# Altium schematic sheet STM32&Power.SchDoc
size A2
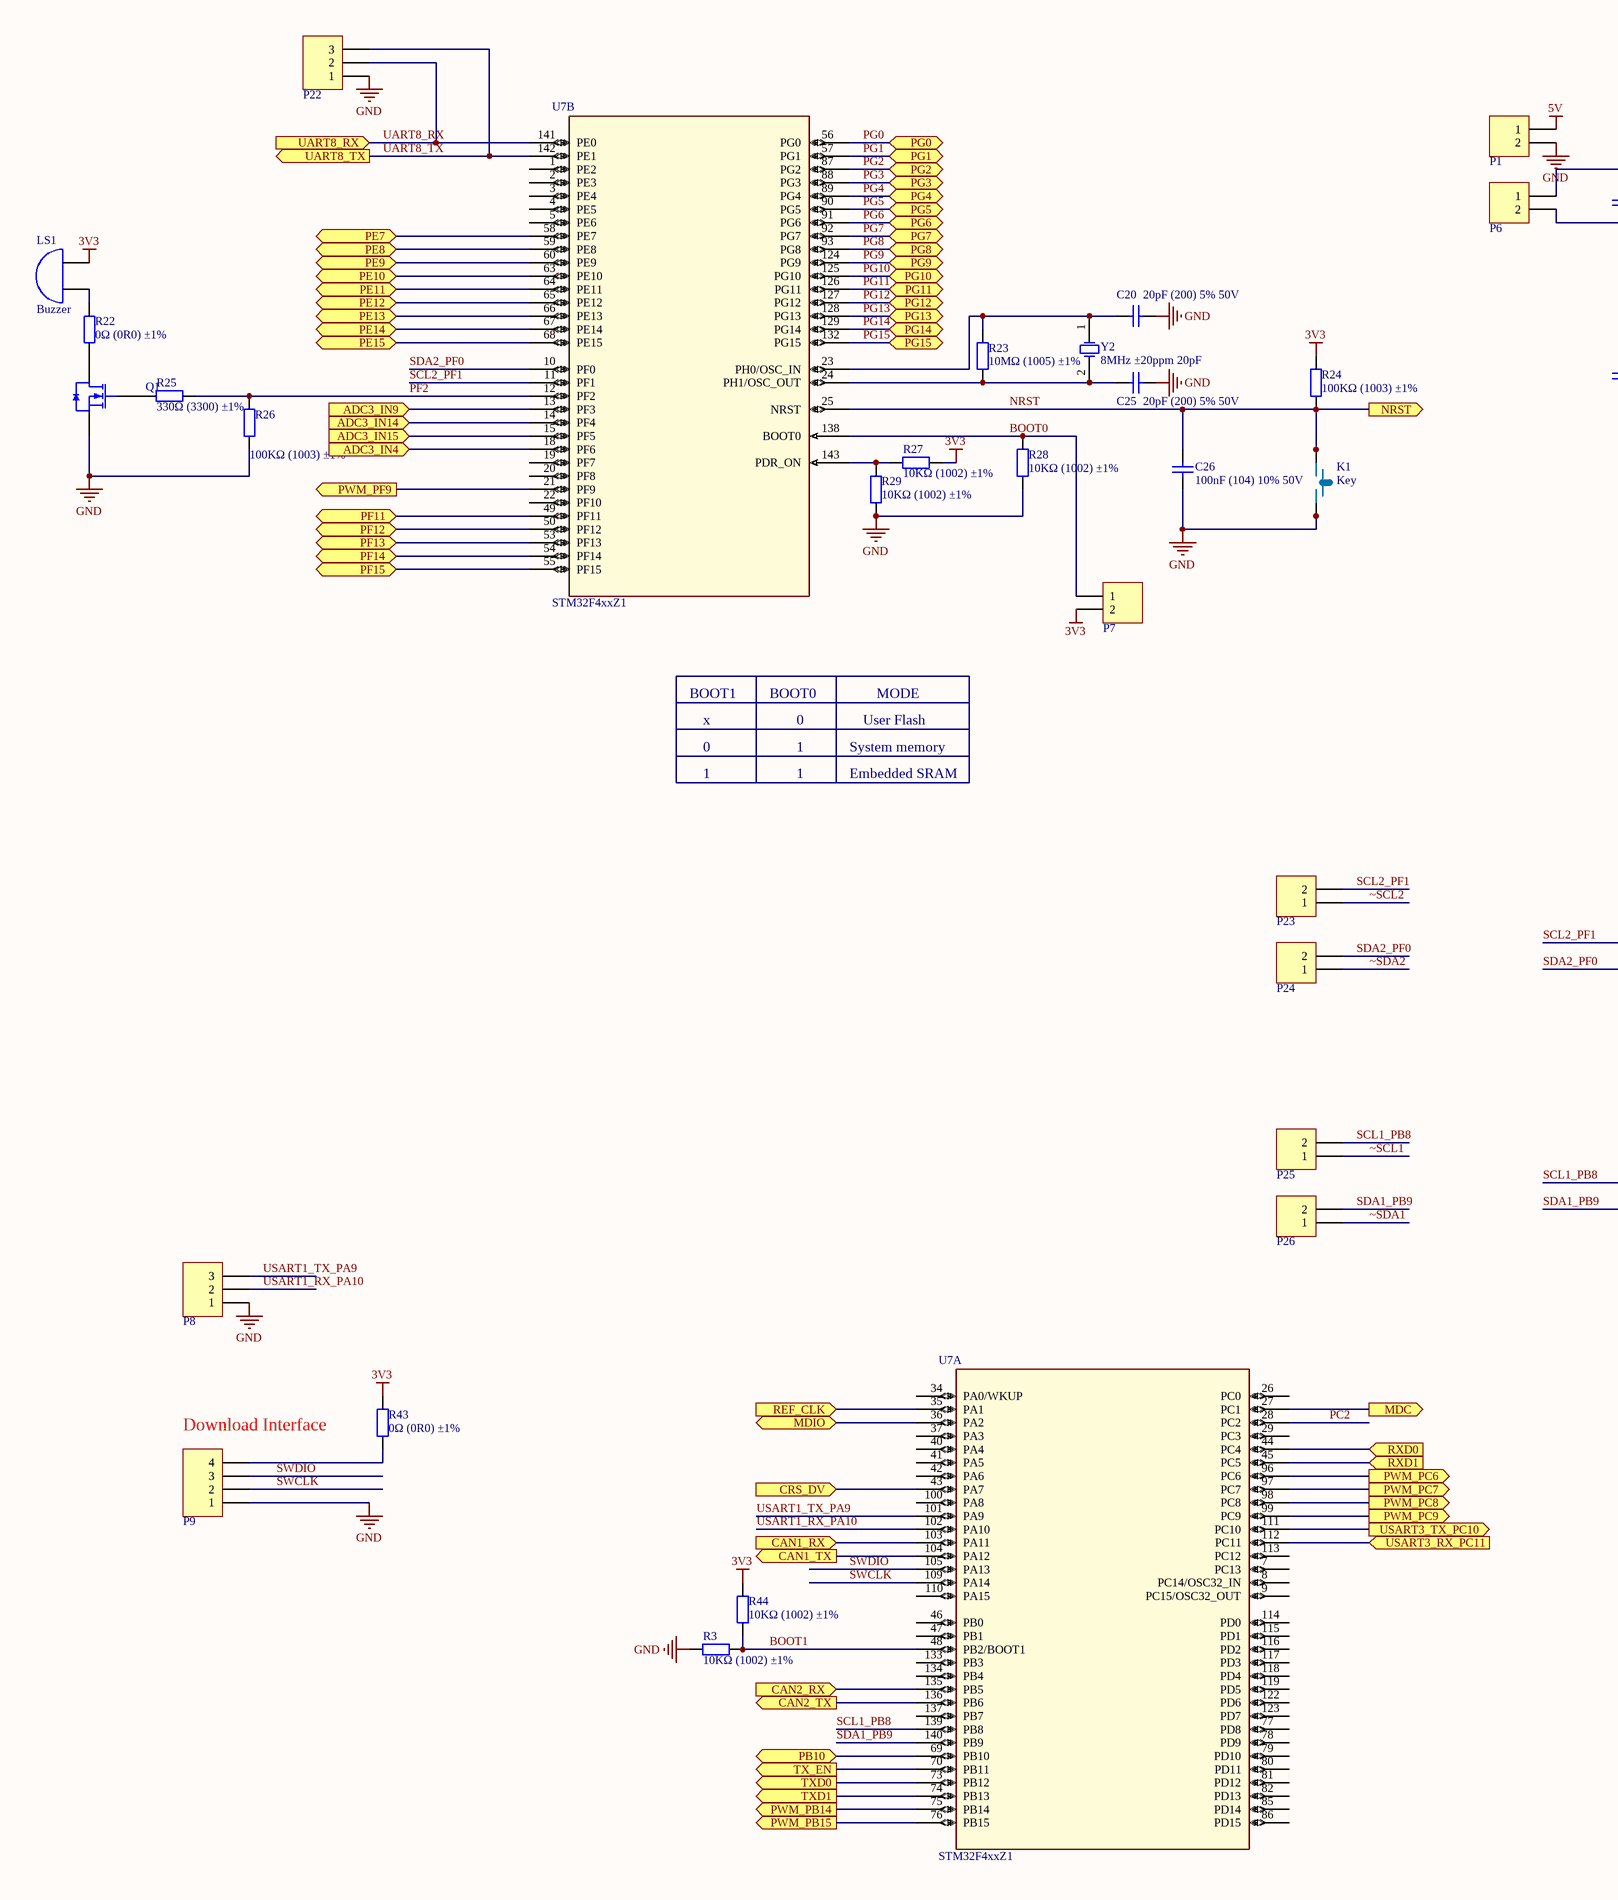
[diagram p0: STM32&Power.SchDoc, left]
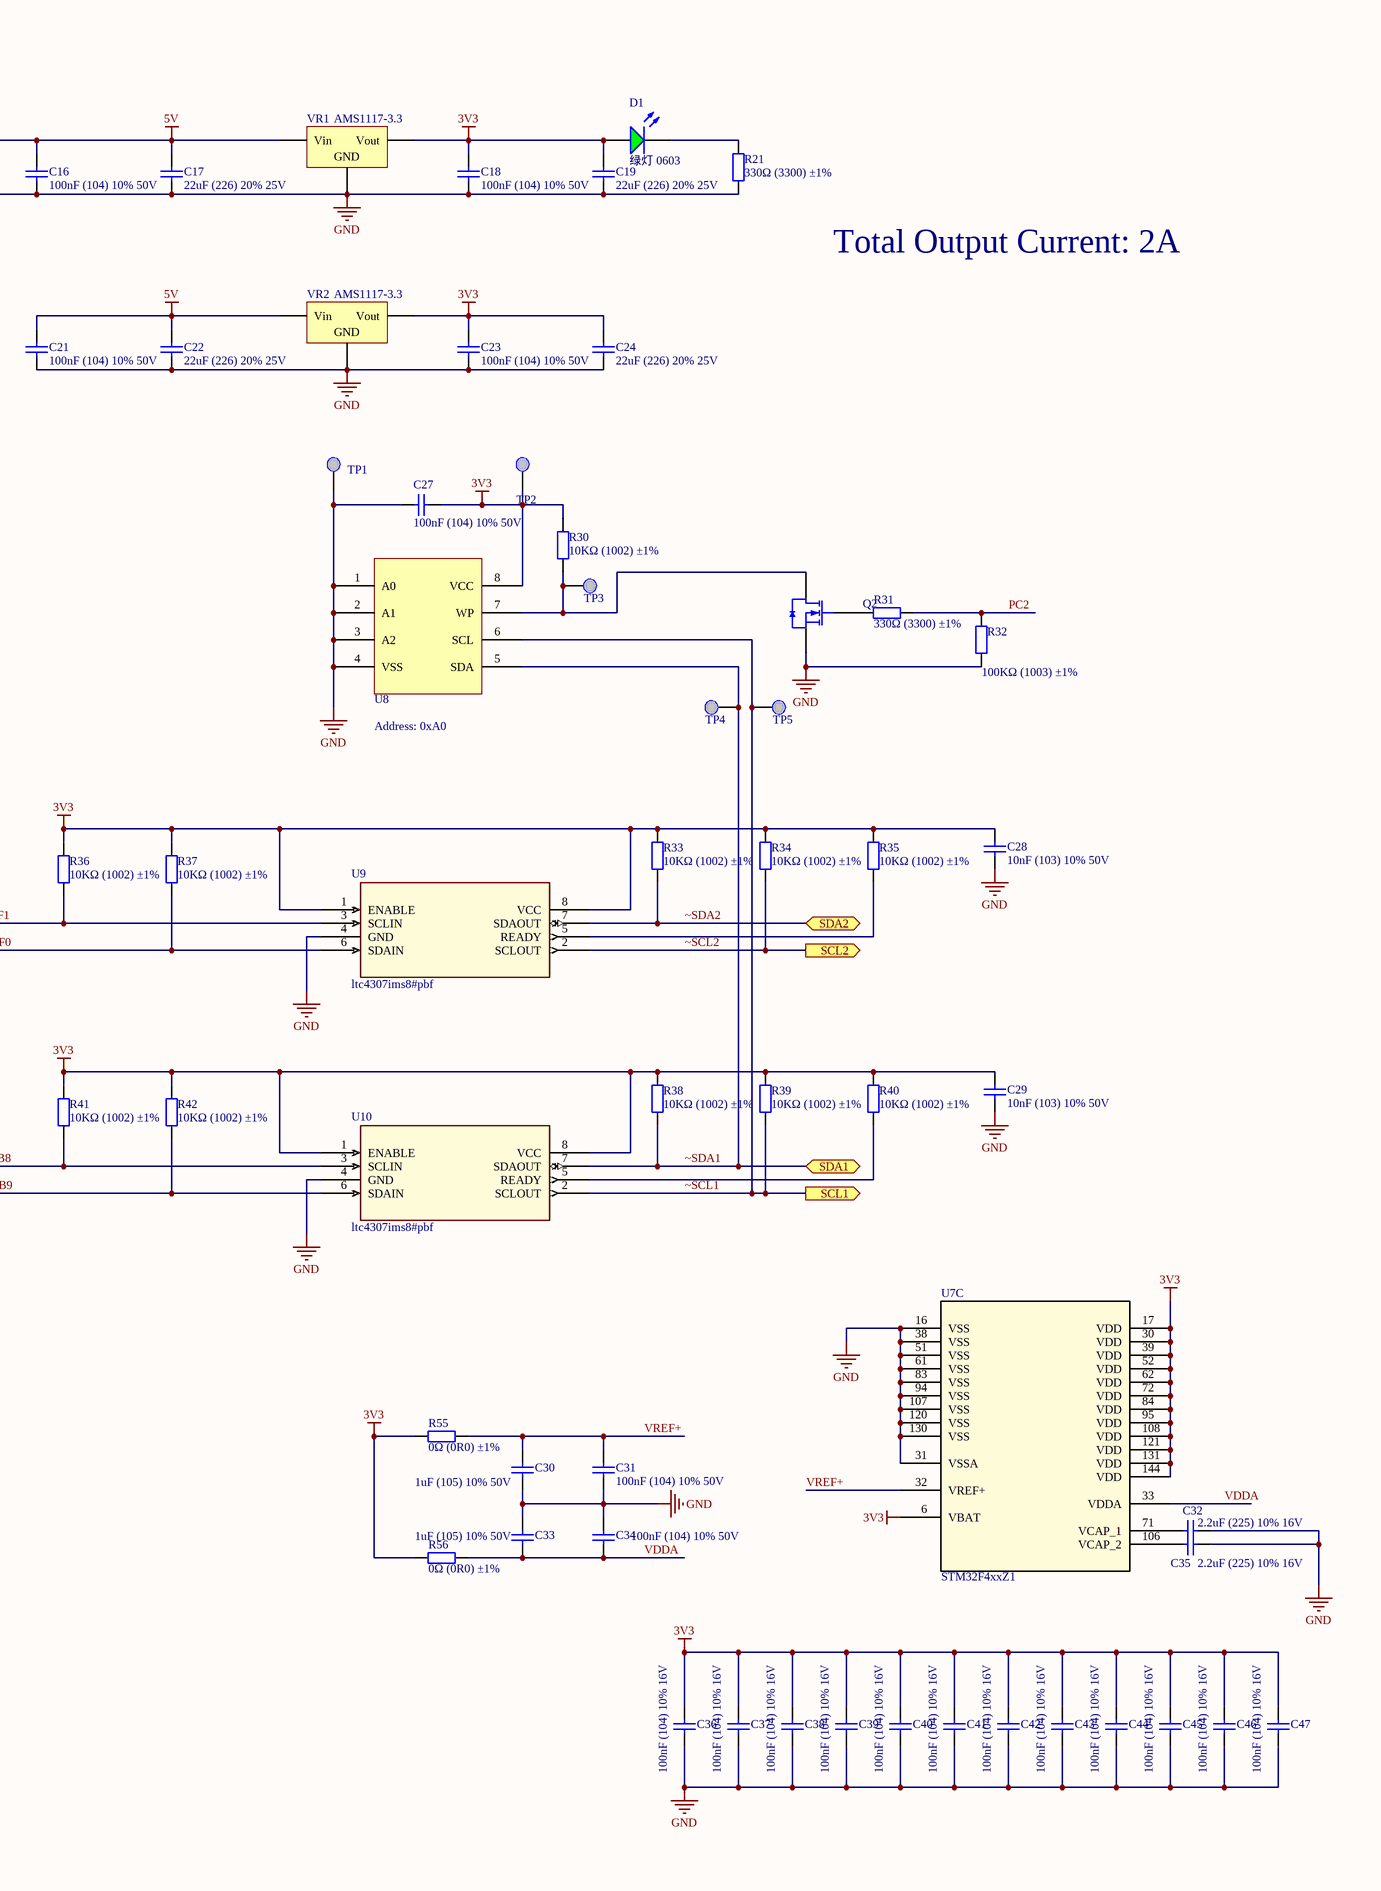
[diagram p1: STM32&Power.SchDoc, right]

## Parts
C16  100nF (104) 10% 50V  [0603_C]
C17  22uF (226) 20% 25V  [0805_C]
C18  100nF (104) 10% 50V  [0603_C]
C19  22uF (226) 20% 25V  [0805_C]
C20  20pF (200) 5% 50V  [0603_C]
C21  100nF (104) 10% 50V  [0603_C]
C22  22uF (226) 20% 25V  [0805_C]
C23  100nF (104) 10% 50V  [0603_C]
C24  22uF (226) 20% 25V  [0805_C]
C25  20pF (200) 5% 50V  [0603_C]
C26  100nF (104) 10% 50V  [0603_C]
C27  100nF (104) 10% 50V  [0603_C]
C28  10nF (103) 10% 50V  [0603_C]
C29  10nF (103) 10% 50V  [0603_C]
C30  1uF (105) 10% 50V  [0603_C]
C31  100nF (104) 10% 50V  [0603_C]
C32  2.2uF (225) 10% 16V  [0603_C]
C33  1uF (105) 10% 50V  [0603_C]
C34  100nF (104) 10% 50V  [0603_C]
C35  2.2uF (225) 10% 16V  [0603_C]
C36  100nF (104) 10% 16V  [0402_C]
C37  100nF (104) 10% 16V  [0402_C]
C38  100nF (104) 10% 16V  [0402_C]
C39  100nF (104) 10% 16V  [0402_C]
C40  100nF (104) 10% 16V  [0402_C]
C41  100nF (104) 10% 16V  [0402_C]
C42  100nF (104) 10% 16V  [0402_C]
C43  100nF (104) 10% 16V  [0402_C]
C44  100nF (104) 10% 16V  [0402_C]
C45  100nF (104) 10% 16V  [0402_C]
C46  100nF (104) 10% 16V  [0402_C]
C47  100nF (104) 10% 16V  [0402_C]
D1  绿灯 0603  [0603_LED_S1]
K1  Key  [Key]
LS1  Buzzer  [buzzer]
P1  0.1" 2POS Header SNGL  [2 POS HEADER SINGLE ROW]  (value not drawn)
P6  B2B-PH-SM4-TB(LF)(SN)  [B2B-PH-SM4-TB(LF)(SN)]  (value not drawn)
P7  0.1" 2POS Header SNGL  [2 POS HEADER SINGLE ROW]  (value not drawn)
P8  0.1" 3POS Header SNGL  [3 POS HEADER SINGLE ROW]  (value not drawn)
P9  0.1" 4POS Header SNGL  [4 POS HEADER SINGLE ROW]  (value not drawn)
P22  0.1" 3POS Header SNGL  [3 POS HEADER SINGLE ROW]  (value not drawn)
P23  0.1" 2POS Header SNGL  [2 POS HEADER SINGLE ROW]  (value not drawn)
P24  0.1" 2POS Header SNGL  [2 POS HEADER SINGLE ROW]  (value not drawn)
P25  0.1" 2POS Header SNGL  [2 POS HEADER SINGLE ROW]  (value not drawn)
P26  0.1" 2POS Header SNGL  [2 POS HEADER SINGLE ROW]  (value not drawn)
Q1  AO3400A N道沟 X0YV1T SOT-23  [SOT-23-3L]  (value not drawn)
Q2  AO3400A N道沟 X0YV1T SOT-23  [SOT-23-3L]  (value not drawn)
R3  10KΩ (1002) ±1%  [0603_R]
R21  330Ω (3300) ±1%  [0603_R]
R22  0Ω (0R0) ±1%  [0603_R]
R23  10MΩ (1005) ±1%  [0603_R]
R24  100KΩ (1003) ±1%  [0603_R]
R25  330Ω (3300) ±1%  [0603_R]
R26  100KΩ (1003) ±1%  [0603_R]
R27  10KΩ (1002) ±1%  [0603_R]
R28  10KΩ (1002) ±1%  [0603_R]
R29  10KΩ (1002) ±1%  [0603_R]
R30  10KΩ (1002) ±1%  [0603_R]
R31  330Ω (3300) ±1%  [0603_R]
R32  100KΩ (1003) ±1%  [0603_R]
R33  10KΩ (1002) ±1%  [0603_R]
R34  10KΩ (1002) ±1%  [0603_R]
R35  10KΩ (1002) ±1%  [0603_R]
R36  10KΩ (1002) ±1%  [0603_R]
R37  10KΩ (1002) ±1%  [0603_R]
R38  10KΩ (1002) ±1%  [0603_R]
R39  10KΩ (1002) ±1%  [0603_R]
R40  10KΩ (1002) ±1%  [0603_R]
R41  10KΩ (1002) ±1%  [0603_R]
R42  10KΩ (1002) ±1%  [0603_R]
R43  0Ω (0R0) ±1%  [0603_R]
R44  10KΩ (1002) ±1%  [0603_R]
R55  0Ω (0R0) ±1%  [0603_R]
R56  0Ω (0R0) ±1%  [0603_R]
TP1  Test Point, 60mil  [test_point_60_mil]  (value not drawn)
TP2  Test Point, 60mil  [test_point_60_mil]  (value not drawn)
TP3  Test Point, 60mil  [test_point_60_mil]  (value not drawn)
TP4  Test Point, 60mil  [test_point_60_mil]  (value not drawn)
TP5  Test Point, 60mil  [test_point_60_mil]  (value not drawn)
U7  STM32F4xxZ1  [LQFP-144_20x20x05P]  (parts A,B,C of 3)
U8  M24C02-WMN6TP  [SOIC127P600-8CM]  (value not drawn)
U9  ltc4307ims8#pbf  [MSOP-8_MS]
U10  ltc4307ims8#pbf  [MSOP-8_MS]
VR1  AMS1117-3.3  [SOT-223]
VR2  AMS1117-3.3  [SOT-223]
Y2  8MHz ±20ppm 20pF  [SMD-5032_2P]

## Ports
ADC3_IN4 (in), ADC3_IN9 (in), ADC3_IN14 (in), ADC3_IN15 (in), CAN1_RX (in), CAN1_TX (out), CAN2_RX (in), CAN2_TX (out), CRS_DV (in), MDC (out), MDIO (bidir), NRST (out), PB10 (bidir), PE7 (bidir), PE8 (bidir), PE9 (bidir), PE10 (bidir), PE11 (bidir), PE12 (bidir), PE13 (bidir), PE14 (bidir), PE15 (bidir), PF11 (bidir), PF12 (bidir), PF13 (bidir), PF14 (bidir), PF15 (bidir), PG0 (bidir), PG1 (bidir), PG2 (bidir), PG3 (bidir), PG4 (bidir), PG5 (bidir), PG6 (bidir), PG7 (bidir), PG8 (bidir), PG9 (bidir), PG10 (bidir), PG11 (bidir), PG12 (bidir), PG13 (bidir), PG14 (bidir), PG15 (bidir), PWM_PB14 (out), PWM_PB15 (out), PWM_PC6 (out), PWM_PC7 (out), PWM_PC8 (out), PWM_PC9 (out), PWM_PF9 (out), REF_CLK (in), RXD0 (in), RXD1 (in), SCL1 (out), SCL2 (out), SDA1 (bidir), SDA2 (bidir), TX_EN (out), TXD0 (out), TXD1 (out), UART8_RX (in), UART8_TX (out), USART3_RX_PC11 (in), USART3_TX_PC10 (out)

## Nets
3V3: C18.2 C19.2 C23.2 C24.2 C27.1 C28.2 C29.2 C36.2 C37.2 C38.2 C39.2 C40.2 C41.2 C42.2 C43.2 C44.2 C45.2 C46.2 C47.2 D1.A LS1.1(A) P7.2 R24.2 R27.2 R30.2 R33.2 R34.2 R35.2 R36.2 R37.2 R38.2 R39.2 R40.2 R41.2 R42.2 R43.2 R44.2 R55.1 R56.1 TP2.0 U7.6(VBAT) U7.17(VDD) U7.30(VDD) U7.39(VDD) U7.52(VDD) U7.62(VDD) U7.72(VDD) U7.84(VDD) U7.95(VDD) U7.108(VDD) U7.121(VDD) U7.131(VDD) U7.144(VDD) U8.8(VCC) U9.1(ENABLE) U9.8(VCC) U10.1(ENABLE) U10.8(VCC) VR1.2(Vout) VR2.2(Vout)
5V: C16.2 C17.2 C21.2 C22.2 P1.1 P6.1 VR1.3(Vin) VR2.3(Vin)
GND: C16.1 C17.1 C18.1 C19.1 C20.2 C21.1 C22.1 C23.1 C24.1 C25.2 C26.1 C27.2 C28.1 C29.1 C30.2 C31.1 C32.2 C33.1 C34.2 C35.2 C36.1 C37.1 C38.1 C39.1 C40.1 C41.1 C42.1 C43.1 C44.1 C45.1 C46.1 C47.1 K1.3 K1.4 P1.2 P6.2 P8.1 P9.1 P22.1 Q1.2(S) Q2.2(S) R3.2 R21.1 R26.1 R28.1 R29.1 R32.1 TP1.0 U7.16(VSS) U7.31(VSSA) U7.38(VSS) U7.51(VSS) U7.61(VSS) U7.83(VSS) U7.94(VSS) U7.107(VSS) U7.120(VSS) U7.130(VSS) U8.1(A0) U8.2(A1) U8.3(A2) U8.4(VSS) U9.4(GND) U10.4(GND) VR1.1(GND) VR2.1(GND)
ADC3_IN4: U7.18(PF6) ; port ADC3_IN4
ADC3_IN9: U7.13(PF3) ; port ADC3_IN9
ADC3_IN14: U7.14(PF4) ; port ADC3_IN14
ADC3_IN15: U7.15(PF5) ; port ADC3_IN15
BOOT0: P7.1 R28.2 U7.138(BOOT0)
BOOT1: R3.1 R44.1 U7.48(PB2/BOOT1)
CAN1_RX: U7.103(PA11) ; port CAN1_RX
CAN1_TX: U7.104(PA12) ; port CAN1_TX
CAN2_RX: U7.135(PB5) ; port CAN2_RX
CAN2_TX: U7.136(PB6) ; port CAN2_TX
CRS_DV: U7.43(PA7) ; port CRS_DV
MDC: U7.27(PC1) ; port MDC
MDIO: U7.36(PA2) ; port MDIO
NRST: C26.2 K1.1 K1.2 R24.1 U7.25(NRST) ; port NRST
PB10: U7.69(PB10) ; port PB10
PC2: R31.2 R32.2 U7.28(PC2)
PE7: U7.58(PE7) ; port PE7
PE8: U7.59(PE8) ; port PE8
PE9: U7.60(PE9) ; port PE9
PE10: U7.63(PE10) ; port PE10
PE11: U7.64(PE11) ; port PE11
PE12: U7.65(PE12) ; port PE12
PE13: U7.66(PE13) ; port PE13
PE14: U7.67(PE14) ; port PE14
PE15: U7.68(PE15) ; port PE15
PF2: R25.2 R26.2 U7.12(PF2)
PF11: U7.49(PF11) ; port PF11
PF12: U7.50(PF12) ; port PF12
PF13: U7.53(PF13) ; port PF13
PF14: U7.54(PF14) ; port PF14
PF15: U7.55(PF15) ; port PF15
PG0: U7.56(PG0) ; port PG0
PG1: U7.57(PG1) ; port PG1
PG2: U7.87(PG2) ; port PG2
PG3: U7.88(PG3) ; port PG3
PG4: U7.89(PG4) ; port PG4
PG5: U7.90(PG5) ; port PG5
PG6: U7.91(PG6) ; port PG6
PG7: U7.92(PG7) ; port PG7
PG8: U7.93(PG8) ; port PG8
PG9: U7.124(PG9) ; port PG9
PG10: U7.125(PG10) ; port PG10
PG11: U7.126(PG11) ; port PG11
PG12: U7.127(PG12) ; port PG12
PG13: U7.128(PG13) ; port PG13
PG14: U7.129(PG14) ; port PG14
PG15: U7.132(PG15) ; port PG15
PWM_PB14: U7.75(PB14) ; port PWM_PB14
PWM_PB15: U7.76(PB15) ; port PWM_PB15
PWM_PC6: U7.96(PC6) ; port PWM_PC6
PWM_PC7: U7.97(PC7) ; port PWM_PC7
PWM_PC8: U7.98(PC8) ; port PWM_PC8
PWM_PC9: U7.99(PC9) ; port PWM_PC9
PWM_PF9: U7.21(PF9) ; port PWM_PF9
REF_CLK: U7.35(PA1) ; port REF_CLK
RXD0: U7.44(PC4) ; port RXD0
RXD1: U7.45(PC5) ; port RXD1
SCL1_PB8: P25.2 R41.1 U7.139(PB8) U10.3(SCLIN)
SCL2_PF1: P23.2 R36.1 U7.11(PF1) U9.3(SCLIN)
SDA1_PB9: P26.2 R42.1 U7.140(PB9) U10.6(SDAIN)
SDA2_PF0: P24.2 R37.1 U7.10(PF0) U9.6(SDAIN)
SWCLK: P9.2 U7.109(PA14)
SWDIO: P9.3 U7.105(PA13)
TX_EN: U7.70(PB11) ; port TX_EN
TXD0: U7.73(PB12) ; port TXD0
TXD1: U7.74(PB13) ; port TXD1
UART8_RX: P22.2 U7.141(PE0) ; port UART8_RX
UART8_TX: P22.3 U7.142(PE1) ; port UART8_TX
USART1_RX_PA10: P8.2 U7.102(PA10)
USART1_TX_PA9: P8.3 U7.101(PA9)
USART3_RX_PC11: U7.112(PC11) ; port USART3_RX_PC11
USART3_TX_PC10: U7.111(PC10) ; port USART3_TX_PC10
VDDA: C33.2 C34.1 R56.2 U7.33(VDDA)
VREF+: C30.1 C31.2 R55.2 U7.32(VREF+)
~SCL1: P25.1 R39.1 TP5.0 U8.6(SCL) U10.2(SCLOUT) ; port SCL1
~SCL2: P23.1 R34.1 U9.2(SCLOUT) ; port SCL2
~SDA1: P26.1 R38.1 TP4.0 U8.5(SDA) U10.7(SDAOUT) ; port SDA1
~SDA2: P24.1 R33.1 U9.7(SDAOUT) ; port SDA2
NetC20_1: C20.1 R23.2 U7.23(PH0/OSC_IN) Y2.1(OSC1)
NetC25_1: C25.1 R23.1 U7.24(PH1/OSC_OUT) Y2.2(OSC2)
NetC32_1: C32.1 U7.71(VCAP_1)
NetC35_1: C35.1 U7.106(VCAP_2)
NetD1_K: D1.K R21.2
NetLS1_2: LS1.2(B) R22.2
NetP9_4: P9.4 R43.1
NetQ1_1: Q1.1(G) R25.1
NetQ1_3: Q1.3(D) R22.1
NetQ2_1: Q2.1(G) R31.1
NetQ2_3: Q2.3(D) R30.1 TP3.0 U8.7(WP)
NetR27_1: R27.1 R29.2 U7.143(PDR_ON)
NetR35_1: R35.1 U9.5(READY)
NetR40_1: R40.1 U10.5(READY)

Not connected (* = marked no-connect by the designer): U7 1(PE2) 2(PE3) 3(PE4) 4(PE5) 5(PE6) 7(PC13) 8(PC14/OSC32_IN) 9(PC15/OSC32_OUT) 19(PF7) 20(PF8) 22(PF10) 26(PC0) 29(PC3) 34(PA0/WKUP) 37(PA3) 40(PA4) 41(PA5) 42(PA6) 46(PB0) 47(PB1) 77(PD8) 78(PD9) 79(PD10) 80(PD11) 81(PD12) 82(PD13) 85(PD14) 86(PD15) 100(PA8) 110(PA15) 113(PC12) 114(PD0) 115(PD1) 116(PD2) 117(PD3) 118(PD4) 119(PD5) 122(PD6) 123(PD7) 133(PB3) 134(PB4) 137(PB7)

## Notes on the sheet
- Total Output Current: 2A
- BOOT1
- x
- BOOT0
- 0
- User Flash
- MODE
- 1
- System memory
- Embedded SRAM
- Address: 0xA0
- Download Interface

## Library data of the parts
C16 C18 C21 C23 C26 C27 C31 C34 = 0603 100nF (104) 10% 50V: 贴片电容; ComponentLink1Description: 供应商链接; ComponentLink1URL: http://www.szlcsc.com/product/details_15331.html; Package: 0603; Supplier: LC; SuppliersPartNumber: C14663
C17 C19 C22 C24 = 0805 22uF (226) 20% 25V: 贴片电容; ComponentLink1Description: 供应商链接; ComponentLink1URL: http://www.szlcsc.com/product/details_46786.html; Package: 0805; Supplier: LC; SuppliersPartNumber: C45783
C20 C25 = 0603 20pF (200) 5% 50V: 贴片电容; ComponentLink1Description: 供应商链接; ComponentLink1URL: http://www.szlcsc.com/product/details_2000.html; Package: 0603; Supplier: LC; SuppliersPartNumber: C1648
C28 C29 = 0603 10nF (103) 10% 50V: 贴片电容; ComponentLink1Description: 供应商链接; ComponentLink1URL: http://www.szlcsc.com/product/details_58143.html; Package: 0603; Supplier: LC; SuppliersPartNumber: C57112
C30 C33 = 0603 1uF (105) 10% 50V: 贴片电容; ComponentLink1Description: 供应商链接; ComponentLink1URL: http://www.szlcsc.com/product/details_16531.html; Package: 0603; Supplier: LC; SuppliersPartNumber: C15849
C32 C35 = 0603 2.2uF (225) 10% 16V: 贴片电容; ComponentLink1Description: 供应商链接; ComponentLink1URL: http://www.szlcsc.com/product/details_24366.html; Package: 0603; Supplier: LC; SuppliersPartNumber: C23630
C36-C47 = 0402 100nF (104) 10% 16V: 贴片电容; ComponentLink1Description: 供应商链接; ComponentLink1URL: http://www.szlcsc.com/product/details_1877.html; Package: 0402; Supplier: LC; SuppliersPartNumber: C1525
D1 = 0603 绿灯: 发光二极管; ComponentLink1Description: 供应商链接; ComponentLink1URL: http://www.szlcsc.com/product/details_73152.html; Package: 0603; Supplier: LC; SuppliersPartNumber: C72043
LS1 = Bell: Electrical Bell; Published: 24-Mar-1999; LatestRevisionDate: 17-Jul-2002; LatestRevisionNote: Re-released for DXP Platform.; PackageReference: PIN2; Publisher: Altium Limited
P1 P7 P23-P26 = CONN HEADER 2POS .100" SNGL TIN: Manufacturer: Samtec Inc; Manufacturer Part Number: TSW-150-08-T-S; Unit Price in Quantity: 1.0189; Part Number: CONN HEADER 2POS .100" SNGL TIN; Mounting Type: thru-hole; Package: header; Component Type: Standard; Pin Count: 2; Supplier 1: Digikey; Supplier 1 Part Number: SAM1050-50-ND; Unit Price-Supplier 1: 2.24; Price Break: 1000; Vendor/Distributor: Digikey
P6 = CONN HEADER PH TOP 2POS 2MM SMD: Manufacturer: JST Sales America Inc.; Unit Price in Quantity: .3467; Part Number: CONN HEADER PH TOP 2POS 2MM SMD; Mounting Type: SMD; Package: header; Component Type: Standard; Pin Count: 2; Manufacturer Part Number: B2B-PH-SM4-TB(LF)(SN); Supplier 1: Digikey; Supplier 1 Part Number: 455-1734-1-ND; Unit Price-Supplier 1: .55; Price Break: 500; Vendor/Distributor: Digikey
P8 P22 = CONN HEADER 3POS .100" SNGL TIN: Manufacturer: Samtec Inc; Manufacturer Part Number: TSW-150-08-T-S; Unit Price in Quantity: 1.0189; Part Number: CONN HEADER 3POS .100" SNGL TIN; Mounting Type: thru-hole; Package: header; Component Type: Standard; Pin Count: 3; Supplier 1: Digikey; Supplier 1 Part Number: SAM1050-50-ND; Unit Price-Supplier 1: 2.24; Price Break: 1000; Vendor/Distributor: Digikey
P9 = CONN HEADER 4POS .100" SNGL TIN: Manufacturer: Samtec Inc; Manufacturer Part Number: TSW-150-08-T-S; Unit Price in Quantity: 1.0189; Part Number: CONN HEADER 4POS .100" SNGL TIN; Mounting Type: thru-hole; Package: header; Component Type: Standard; Pin Count: 4; Supplier 1: Digikey; Supplier 1 Part Number: SAM1050-50-ND; Unit Price-Supplier 1: 2.24; Price Break: 1000; Vendor/Distributor: Digikey
Q1 Q2 = AO3400A N道沟 X0YV1T SOT-23: MOS(场效应管); ComponentLink1Description: 供应商链接; ComponentLink1URL: http://www.szlcsc.com/product/details_21629.html; Package: SOT-23; Supplier: LC; SuppliersPartNumber: C20917
R3 R27-R30 R33-R42 R44 = 0603 10KΩ (1002) 1%: 贴片电阻; ComponentLink1Description: 供应商链接; ComponentLink1URL: http://www.szlcsc.com/product/details_26547.html; Package: 0603; Supplier: LC; SuppliersPartNumber: C25804
R21 R25 R31 = 0603 330Ω (3300) 1%: 贴片电阻; ComponentLink1Description: 供应商链接; ComponentLink1URL: http://www.szlcsc.com/product/details_23865.html; Package: 0603; Supplier: LC; SuppliersPartNumber: C23138
R22 R43 R55 R56 = 0603 0Ω (0R0) 1%: 贴片电阻; ComponentLink1Description: 供应商链接; ComponentLink1URL: http://www.szlcsc.com/product/details_21903.html; Package: 0603; Supplier: LC; SuppliersPartNumber: C21189
R23 = 0603 10MΩ (1005) 1%: 贴片电阻; ComponentLink1Description: 供应商链接; ComponentLink1URL: http://www.szlcsc.com/product/details_7726.html; Package: 0603; Supplier: LC; SuppliersPartNumber: C7250
R24 R26 R32 = 0603 100KΩ (1003) 1%: 贴片电阻; ComponentLink1Description: 供应商链接; ComponentLink1URL: http://www.szlcsc.com/product/details_26546.html; Package: 0603; Supplier: LC; SuppliersPartNumber: C25803
TP1-TP5 = Test Point, 60mil: Designator: TP?; Part Number: Test Point, 60mil; Component Type: Standard (No BOM)
U7 = STM32F4xxZ1: Imported; Vendor: STMicroelectronics; C: Copyright (C) 2016 Accelerated Designs. All rights reserved; Manufacturer_Part_Number: stm32f4xxz1; Copyright: Copyright (C) 2016 Accelerated Designs. All rights reserved; RefDes: RefDes; Type: Type; Value: Value
U8 = M24C02-WMN6TP: IC EEPROM 2KBIT 400KHZ 8SOIC; Manufacturer: STMicroelectronics; Unit Price in Quantity: .2014; Part Number: M24C02-WMN6TP; Component Type: Standard; Pin Count: 8; Manufacturer Part Number: M24C02-WMN6TP; Mounting Type: smt; Package: 8-SOIC; Supplier 1: Digkey; Supplier 1 Part Number: 497-8552-1-ND; Unit Price-Supplier 1: .58; Price Break: 1000; Vendor/Distributor: Digikey
U9 U10 = ltc4307ims8#pbf: Imported; Vendor: Linear Technology; Built_By: EMA_UL_Team; Manufacturer_Part_Number: ltc4307ims8#pbf; RefDes: RefDes; Type: Type; Value: Value
VR1 VR2 = SOT-223 AMS1117-3.3: 低压差线性稳压(LDO); ComponentLink1Description: 供应商链接; ComponentLink1URL: http://www.szlcsc.com/product/details_6652.html; Package: SOT-223; Supplier: LC; SuppliersPartNumber: C6186
Y2 = SMD-5032_2P 8MHz 20ppm 20pF: 贴片晶振; ComponentLink1Description: 供应商链接; ComponentLink1URL: http://www.szlcsc.com/product/details_117214.html; Package: SMD-5032_2P; Supplier: LC; SuppliersPartNumber: C115962